# Altium schematic sheet [01] - COVER PAGE.SchDoc
size A3; DocumentNumber: 1; SheetNumber: 1; SheetTotal: 8
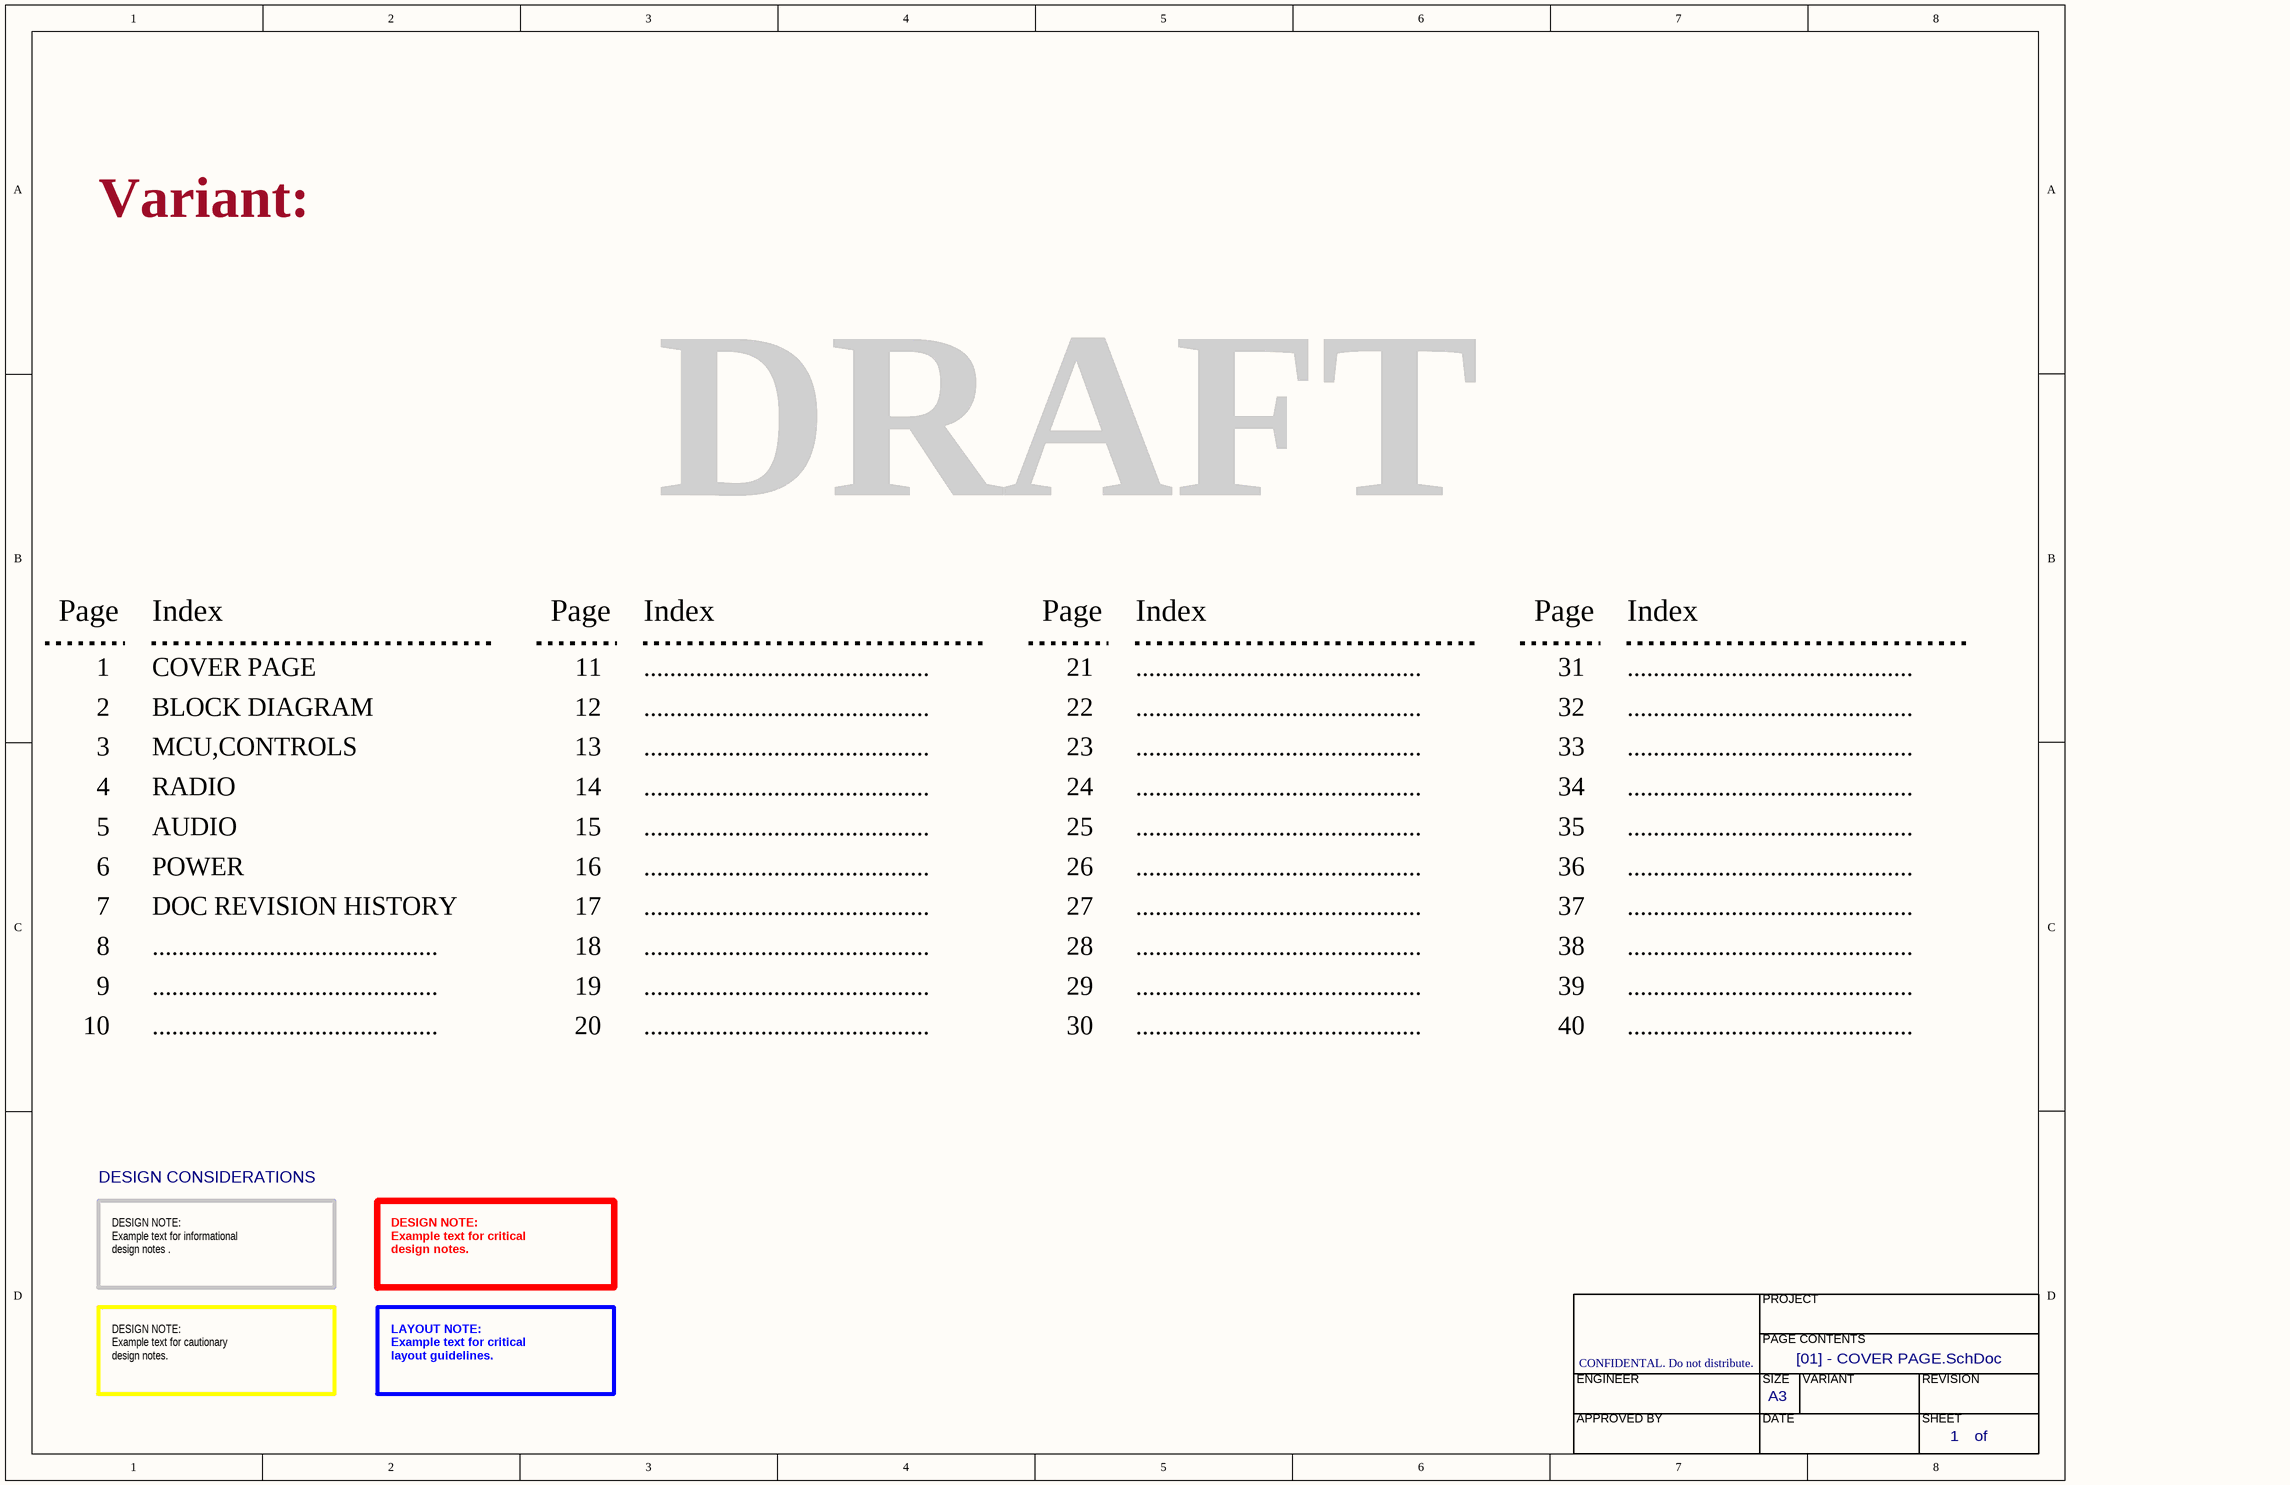
[diagram p0: [01] - COVER PAGE.SchDoc]

## Notes on the sheet
- Variant:
- DRAFT
- Page
- Index
- 1
- COVER PAGE
- 11
- ............................................
- 21
- 31
- 2
- 3
- BLOCK DIAGRAM
- MCU,CONTROLS
- 12
- 13
- 22
- 23
- 32
- 33
- 4
- 5
- RADIO
- AUDIO
- 14
- 15
- 24
- 25
- 34
- 35
- 6
- POWER
- 16
- 26
- 36
- 7
- 8
- DOC REVISION HISTORY
- 17
- 18
- 27
- 28
- 37
- 38
- 9
- 10
- 19
- 20
- 29
- 30
- 39
- 40
- DESIGN CONSIDERATIONS
- DESIGN NOTE:
  Example text for informational
  design notes .
- DESIGN NOTE:
  Example text for critical
  design notes.
- PROJECT
- CONFIDENTAL. Do not distribute.
- PAGE CONTENTS
- DESIGN NOTE:
  Example text for cautionary
  design notes.
- LAYOUT NOTE:
  Example text for critical
  layout guidelines.
- ENGINEER
- APPROVED BY
- SIZE
- DATE
- A3
- VARIANT
- REVISION
- SHEET
- of